# EAGLE design quad (EAGLE 7.1.0)
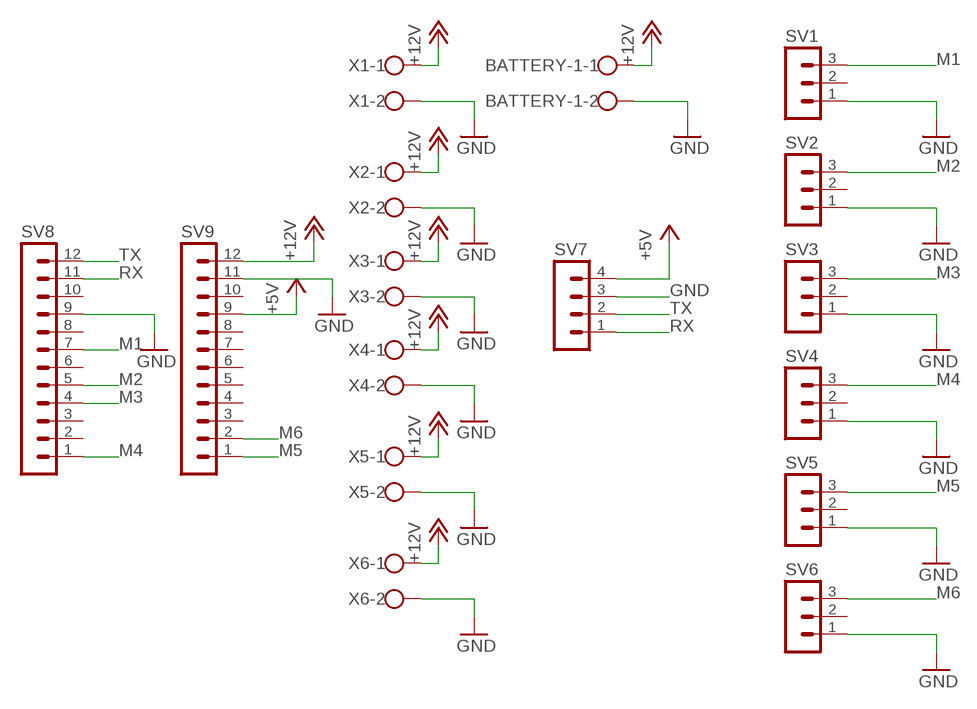
[diagram p0: schematic, sheet 1]

## Parts
BATTERY-1  W237-102  [W237-102]
SV1  MA03-1  [MA03-1]
SV2  MA03-1  [MA03-1]
SV3  MA03-1  [MA03-1]
SV4  MA03-1  [MA03-1]
SV5  MA03-1  [MA03-1]
SV6  MA03-1  [MA03-1]
SV7  MA04-1  [MA04-1]
SV8  MA12-1  [MA12-1]
SV9  MA12-1  [MA12-1]
X1  W237-102  [W237-102]
X2  W237-102  [W237-102]
X3  W237-102  [W237-102]
X4  W237-102  [W237-102]
X5  W237-102  [W237-102]
X6  W237-102  [W237-102]

## Nets
+5V: SV7.4 SV9.9
+12V: BATTERY-1.1 SV9.12 X1.1 X2.1 X3.1 X4.1 X5.1 X6.1
GND: BATTERY-1.2 SV1.1 SV2.1 SV3.1 SV4.1 SV5.1 SV6.1 SV7.3 SV8.9 SV9.11 X1.2 X2.2 X3.2 X4.2 X5.2 X6.2
M1: SV1.3 SV8.7
M2: SV2.3 SV8.5
M3: SV3.3 SV8.4
M4: SV4.3 SV8.1
M5: SV5.3 SV9.1
M6: SV6.3 SV9.2
RX: SV7.1 SV8.11
TX: SV7.2 SV8.12
Unconnected: SV1.2 SV2.2 SV3.2 SV4.2 SV5.2 SV6.2 SV8.2 SV8.3 SV8.6 SV8.8 SV8.10 SV9.3 SV9.4 SV9.5 SV9.6 SV9.7 SV9.8 SV9.10

## Library data of the parts
BATTERY-1 X1-X6 = con-wago-500:W237-102: WAGO SCREW CLAMP; MPN: 237-102; OC_FARNELL: unknown; OC_NEWARK: 70K9898
SV1-SV6 = con-lstb:MA03-1: PIN HEADER; OC_FARNELL: unknown; OC_NEWARK: unknown
SV7 = con-lstb:MA04-1: PIN HEADER; OC_FARNELL: unknown; OC_NEWARK: unknown
SV8 SV9 = con-lstb:MA12-1: PIN HEADER; OC_FARNELL: unknown; OC_NEWARK: unknown

## Board
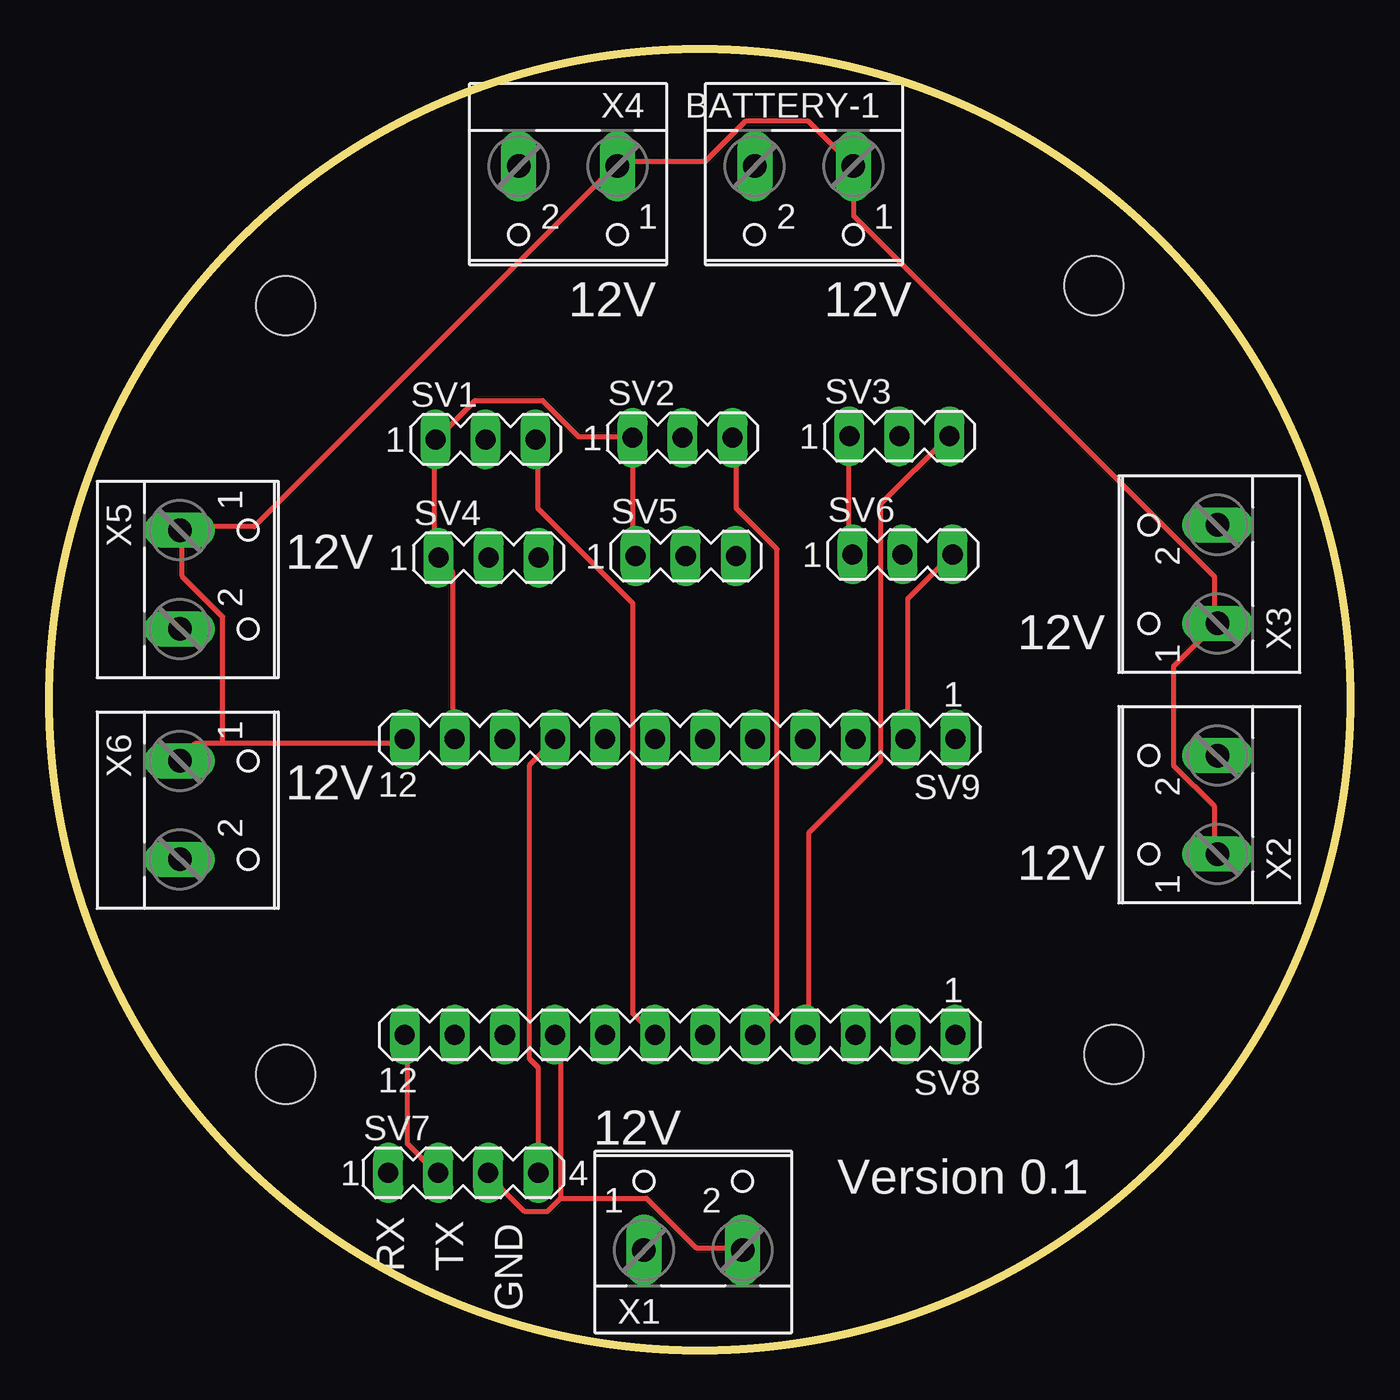
[diagram p1: board, top side]
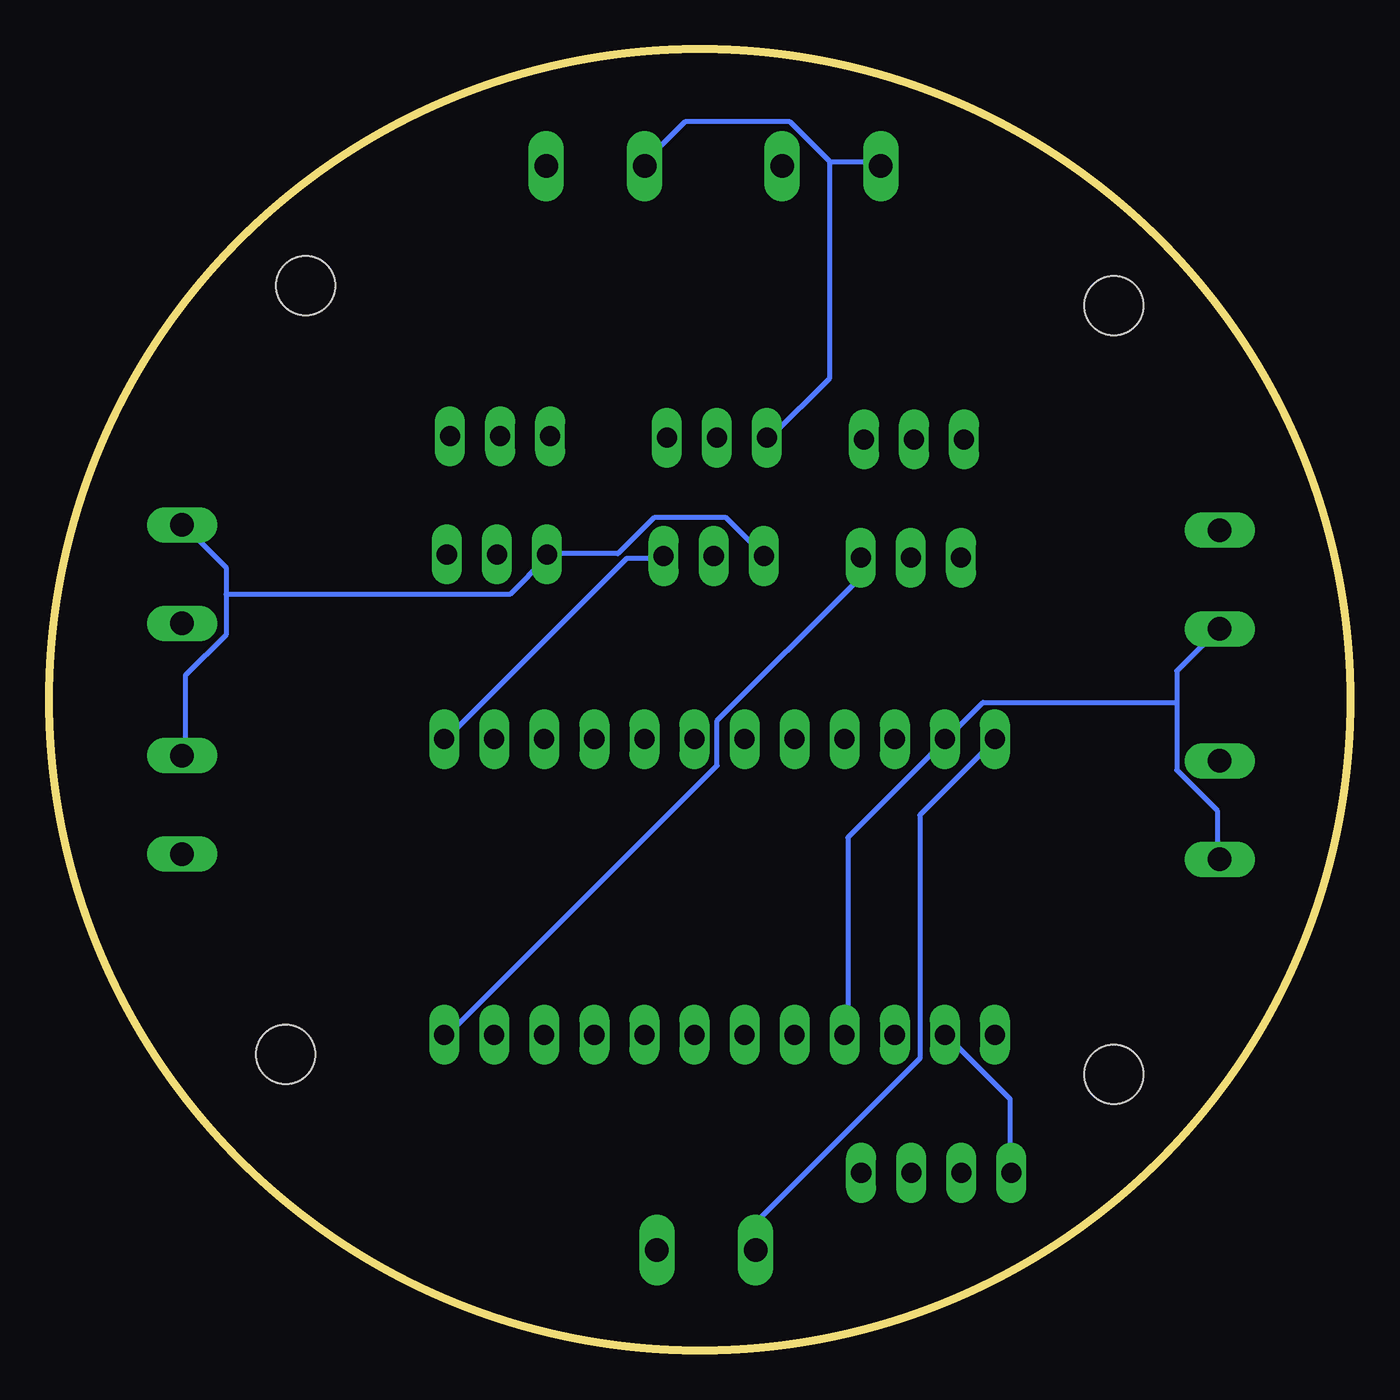
[diagram p2: board, bottom side, seen from below]

Size 66 x 66 mm. Coordinates in mm from the lower left corner, seen from the top.
Outline: circle at 33,33 radius 33
Copper layers (1*16): Top 0.035mm / dielectric 1.5mm / Bottom 0.035mm
Design rules "default": minimum track width 10mil, minimum drill 24mil, track to track 8mil, track to pad 8mil, pad to pad 8mil, via to via 8mil, smd to smd 8mil, copper to edge 40mil, drill to drill 8mil, minimum pad ring 10mil, minimum via ring 8mil, stop-mask expansion 4mil, vias tented up to drill 0mil, thermal gap 10mil
Holes 3 mm at 12,53 12,14 54,15 53,54

### Footprints (pad centres in the part's own frame; a part is rotated, then mirrored left to right if it is on the bottom)
W237-102 = drill 1.194 long: 1 -2.5,-1.27; 2 2.5,-1.27
MA03-1 = drill 1.016 long: 1 -2.54,0; 2 0,0; 3 2.54,0
MA04-1 = drill 1.016 long: 1 -3.81,0; 2 -1.27,0; 3 1.27,0; 4 3.81,0
MA12-1 = drill 1.016 long: 1 -13.97,0; 2 -11.43,0; 3 -8.89,0; 4 -6.35,0; 5 -3.81,0; 6 -1.27,0; 7 1.27,0; 8 3.81,0; 9 6.35,0; 10 8.89,0; 11 11.43,0; 12 13.97,0

### Placement (x,y rotation side)
BATTERY-1  38.29,58.8 180 top
SV1  22.13,46.21 0 top
SV2  32.13,46.29 0 top
SV3  43.13,46.37 0 top
SV4  22.29,40.21 0 top
SV5  32.29,40.29 0 top
SV6  43.29,40.37 0 top
SV7  21,9 0 top
SV8  32,16 180 top
SV9  32,31 180 top
X1  32.67,6.35 0 top
X2  57.99,27.67 90 top
X3  57.99,39.37 90 top
X4  26.32,58.8 180 top
X5  7.89,39.1 270 top
X6  7.89,27.4 270 top

### Tracks (layer width: path | path; a pad name or v marks a point on that pad's centre or on a via)
+5V
  Top 0.254: SV7.4 24.8,9.09 24.8,14.34 24.34,14.8 24.34,29.66 25.49,30.8 SV9.9
+12V
  Top 0.254: 8.8,30.8 7.43,30.8 6.74,30.12 X6.1 | 8.8,30.8 17.95,30.8 SV9.12 | 8.8,30.8 8.8,37.2 6.74,39.26 6.74,41.55 X5.1 6.74,41.78 10.4,41.78 28.69,60.06 X4.1 28.92,60.29 33.26,60.29 35.32,62.35 38.52,62.35 40.58,60.29 BATTERY-1.1 40.8,60.06 40.8,57.55 59.09,39.26 59.09,36.98 X3.1 59.09,36.75 57.03,34.69 57.03,29.66 59.09,27.6 59.09,25.32 X2.1
  Bottom 0.254: X1.1 30.06,5.2 30.06,6.57 21.83,14.8 21.83,27.15 18.17,30.8 SV9.12
GND
  Top 0.254: 25.95,7.71 25.26,7.03 24.12,7.03 22.29,8.86 SV7.3 | 25.95,7.71 25.95,15.72 25.72,15.95 SV8.9 | 25.95,7.71 30.29,7.71 32.8,5.2 35.09,5.2 X1.2 | SV3.1 40.58,46.35 40.58,40.41 SV6.1 | SV5.1 29.6,40.41 29.6,46.12 SV2.1 29.38,46.35 26.86,46.35 25.03,48.18 21.6,48.18 19.77,46.35 SV1.1 19.55,46.12 19.55,40.41 SV4.1 19.77,40.18 20.46,39.49 20.46,31.03 SV9.11
  Bottom 0.254: 26.4,60.29 23.89,60.29 X4.2 | 26.4,60.29 28.46,62.35 33.72,62.35 35.77,60.29 BATTERY-1.2 | 57.03,38.35 57.03,39.72 59.09,41.78 X3.2 | 57.03,38.35 57.03,36.29 59.09,34.23 59.09,30.35 X2.2 | 8.8,32.86 8.8,34.46 6.74,36.52 X5.2 | 8.8,32.86 8.8,29.43 6.74,27.38 6.74,25.09 X6.2 | SV5.1 29.83,40.41 31.66,42.23 35.32,42.23 37.15,40.41 40.58,40.41 SV6.1 40.8,40.18 42.63,38.35 57.03,38.35 | 8.8,32.86 18.63,32.86 20.46,31.03 SV9.11 20.69,30.8 25.49,26 25.49,16.17 SV8.9 | 26.4,60.29 26.4,49.32 29.38,46.35 SV2.1
M1
  Top 0.254: SV1.3 24.8,46.12 24.8,42.69 29.6,37.89 29.6,17.09 30.52,16.17 SV8.7
M2
  Top 0.254: SV2.3 34.86,46.12 34.86,42.69 36.92,40.63 36.92,17.09 36,16.17 SV8.5
M3
  Top 0.254: SV8.4 38.52,16.17 38.52,26.23 42.18,29.89 42.18,42.92 45.6,46.35 SV3.3
M4
  Bottom 0.254: SV4.3 25.03,40.18 25.03,39.03 32.12,31.95 32.12,29.66 45.83,15.95 SV8.1
M5
  Bottom 0.254: SV5.3 34.86,40.18 36.69,40.18 45.83,31.03 SV9.1
M6
  Top 0.254: SV9.2 43.55,31.03 43.55,38.12 45.6,40.18 SV6.3
RX
  Bottom 0.254: SV7.1 17.26,9.09 17.26,12.74 20.46,15.95 SV8.11
TX
  Top 0.254: SV8.12 18.17,15.95 18.17,10.46 19.55,9.09 SV7.2

### Text on the board
tPlace: 12V | 12V | 12V | 12V | 12V | 12V | 12V | Version 0.1 | RX | TX | GND